# EAGLE design SSB Transceiver_Crystal Ladder Filter (EAGLE 9.4.2)
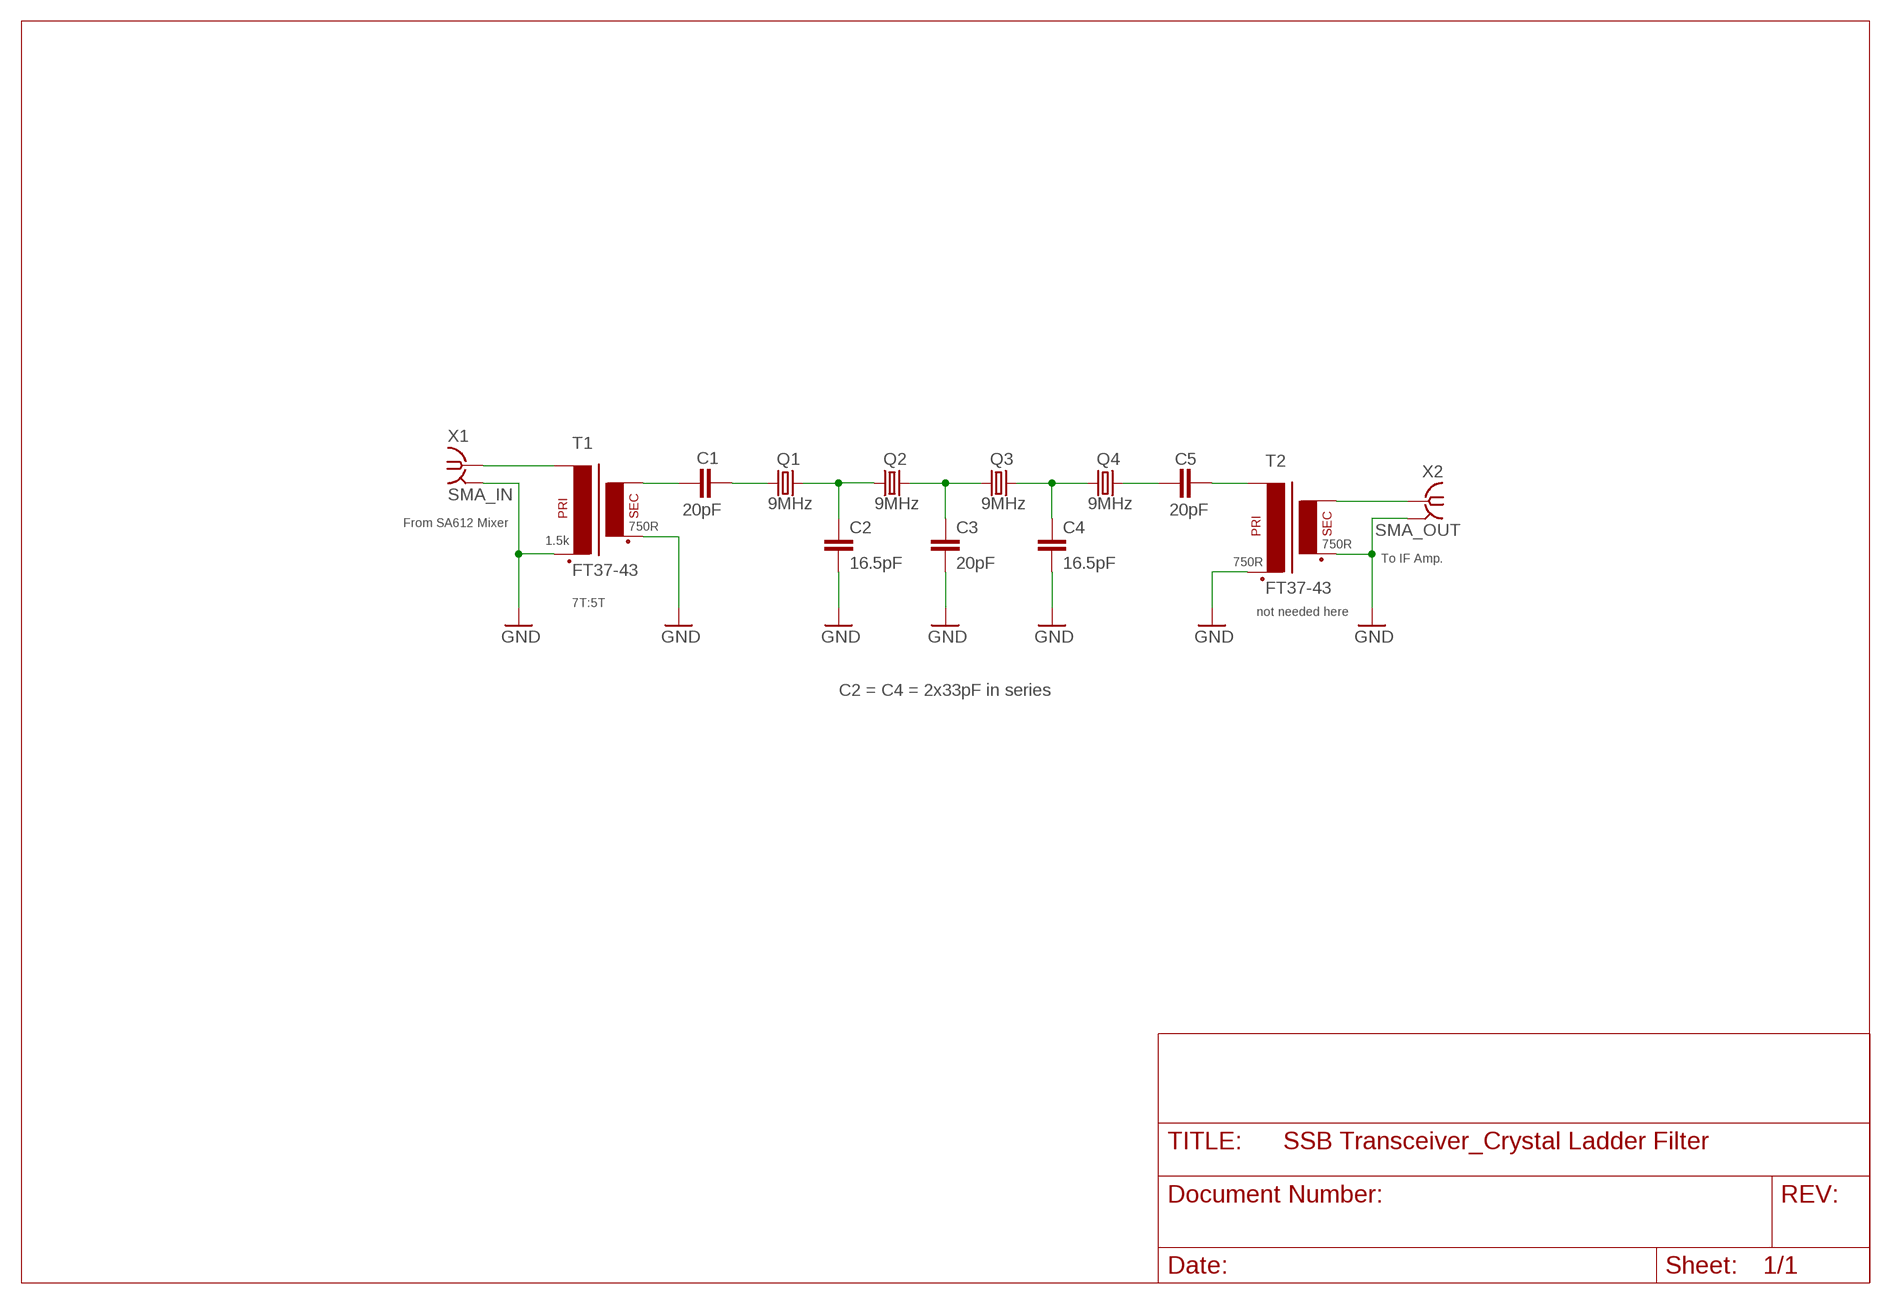
[diagram p0: schematic, sheet 1]

## Parts
C1  20pF  C-EUC0805  [C0805]
C2  16.5pF  C-EUC0805  [C0805]
C3  20pF  C-EUC0805  [C0805]
C4  16.5pF  C-EUC0805  [C0805]
C5  20pF  C-EUC0805  [C0805]
Q1  9MHz  CRYSTALHC49S  [HC49/S]
Q2  9MHz  CRYSTALHC49S  [HC49/S]
Q3  9MHz  CRYSTALHC49S  [HC49/S]
Q4  9MHz  CRYSTALHC49S  [HC49/S]
T1  FT37-43  [FT37-43SMD]
T2  FT37-43  [FT37-43SMD]
X1  SMA_IN  SMA-142-0711-821/826  [J502-ND-142-0711-821/826]
X2  SMA_OUT  SMA-142-0711-821/826  [J502-ND-142-0711-821/826]

## Nets
GND: C2.2 C3.2 C4.2 T1.P$2(P2) T1.S$2(S2) T2.P$2(P2) T2.S$2(S2) X1.G@1 X1.G@2 X1.G@3 X1.G@4 X2.G@1 X2.G@2 X2.G@3 X2.G@4
N$1: C5.2 T2.P$1(P1)
N$2: T2.S$1(S1) X2.1
N$3: C1.1 T1.S$1(S1)
N$4: T1.P$1(P1) X1.1
N$11: C1.2 Q1.1
N$12: C2.1 Q1.2 Q2.1
N$13: C3.1 Q2.2 Q3.1
N$14: C4.1 Q3.2 Q4.1
N$15: C5.1 Q4.2

## Notes on the sheet
- From SA612 Mixer
- 750R
- 1.5k | 750R
- To IF Amp.
- 750R
- 7T:5T
- not needed here
- C2 = C4 = 2x33pF in series

## Library data of the parts
C1-C5 = rcl:C-EU: CAPACITOR, European symbol; SPICEPREFIX: C
Q1-Q4 = crystal:CRYSTAL: CRYSTAL; OC_FARNELL: 1667008; OC_NEWARK: unknown
T1 T2 = Ham Radio:FT37-43
X1 X2 = con-coax:SMA-: SMA 50 Ohm End Launch Jack Receptacle - Round Contact Johnson Components Source: www.johnsoncomponents.com .. J502-ND.pdf; MF: JOHNSON COMPONENTS; MPN: 142-0711-821; OC_FARNELL: 1019328; OC_NEWARK: 16F3627

## Board
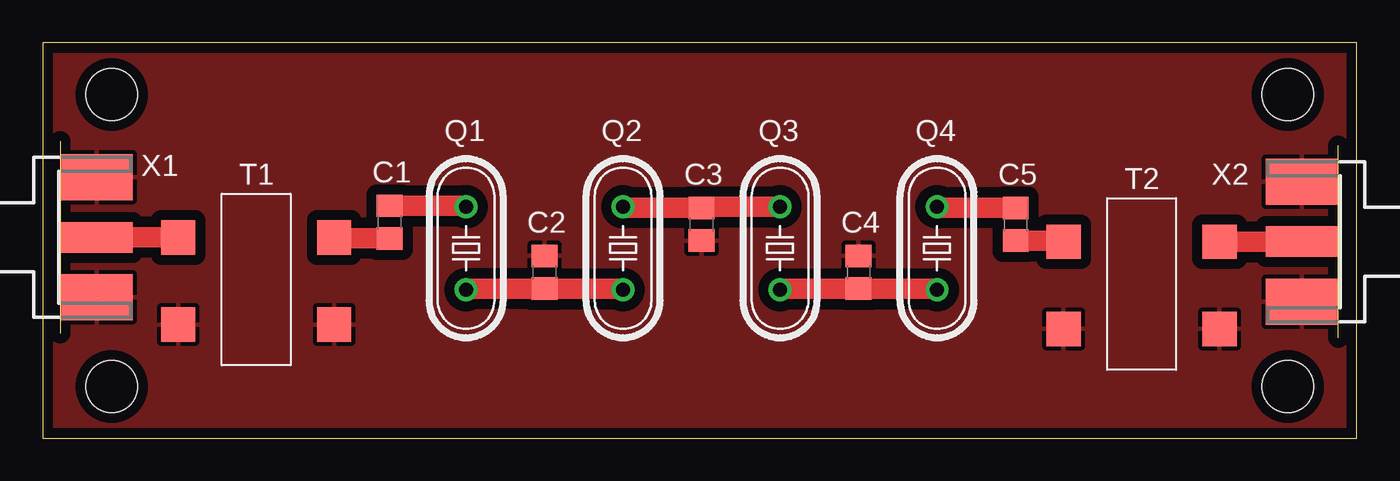
[diagram p1: board, top side]
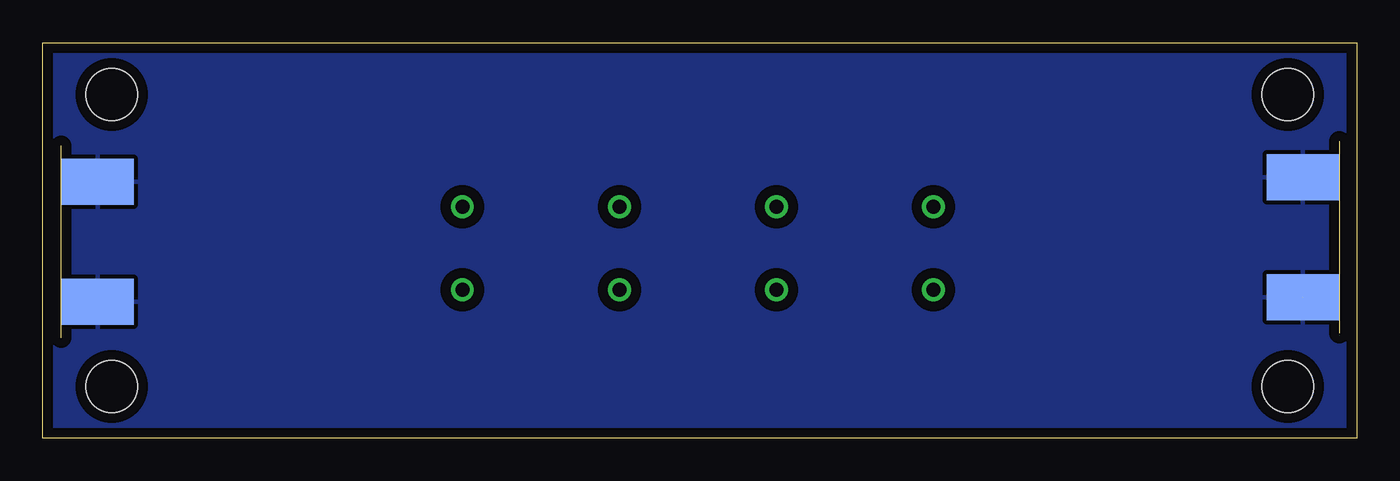
[diagram p2: board, bottom side, seen from below]

Size 76.5 x 23 mm. Coordinates in mm from the lower left corner, seen from the top.
Outline: 0,0 76.5,0 76.5,23 0,23 0,0
Copper layers (1*16): Top 0.035mm / dielectric 1.5mm / Bottom 0.035mm
Design rules "default *": minimum track width 6mil, minimum drill 0.35mm, track to track 20mil, track to pad 20mil, pad to pad 20mil, via to via 20mil, smd to smd 6mil, copper to edge 20mil, drill to drill 6mil, minimum pad ring 10mil, minimum via ring 8mil, stop-mask expansion 4mil, vias tented up to drill 0mil, thermal gap 10mil
Holes 3 mm at 4,3 4,20 72.5,20 72.5,3

### Footprints (pad centres in the part's own frame; a part is rotated, then mirrored left to right if it is on the bottom)
C0805 = smd 1.3 x 1.5: 1 -0.95,0; 2 0.95,0
HC49/S = drill 0.813: 1 -2.413,0; 2 2.413,0
FT37-43SMD = smd 2 x 2: P$1 -5.08,0; P$2 -5.08,-5.08; S$1 4,0; S$2 4,-5.08
J502-ND-142-0711-821/826 = smd 4.191 x 1.778: 1 2.115,0 | smd 4.191 x 2.667: G@1 2.115,3.495; G@2 2.115,-3.495 | smd 4.191 x 2.667 bottom: G@3 2.115,3.495; G@4 2.115,-3.495

### Placement (x,y rotation side)
C1  20.19,12.57 90 top
C2  29.21,9.65 90 top
C3  38.35,12.45 270 top
C4  47.5,9.65 90 top
C5  56.64,12.45 270 top
Q1  24.64,11.05 270 top
Q2  33.78,11.05 90 top
Q3  42.93,11.05 270 top
Q4  52.07,11.05 90 top
T1  12.95,11.68 0 top
T2  64.52,11.43 0 top
X1  1.02,11.68 0 top
X2  75.44,11.43 180 top

### Tracks (layer width: path | path; a pad name or v marks a point on that pad's centre or on a via)
GND  (1 unrouted)
  pour Top (isolate 0.6): 0,0 0,23 76.5,23 76.5,0
  pour Bottom (isolate 0.6): 0,0 0,23 76.5,23 76.5,0
N$1
  Top 1.2: C5.2 59.37,11.5 T2.P$1
N$2
  Top 1.2: T2.S$1 X2.1
N$3
  Top 1.2: C1.1 17.02,11.62 T1.S$1
N$4
  Top 1.2: T1.P$1 X1.1
N$11
  Top 1.2: C1.2 24.58,13.52 Q1.1
N$12
  Top 1.2: Q1.2 24.7,8.7 C2.1 33.72,8.7 Q2.1
N$13
  Top 1.2: Q2.2 33.85,13.4 C3.1 38.42,13.46 Q3.1
N$14
  Top 1.2: Q3.2 42.99,8.7 C4.1 52,8.7 Q4.1
N$15
  Top 1.2: C5.1 52.14,13.4 Q4.2